# Altium schematic sheet Sheet_1_2023-06-10.schdoc
size 316 x 220 mm
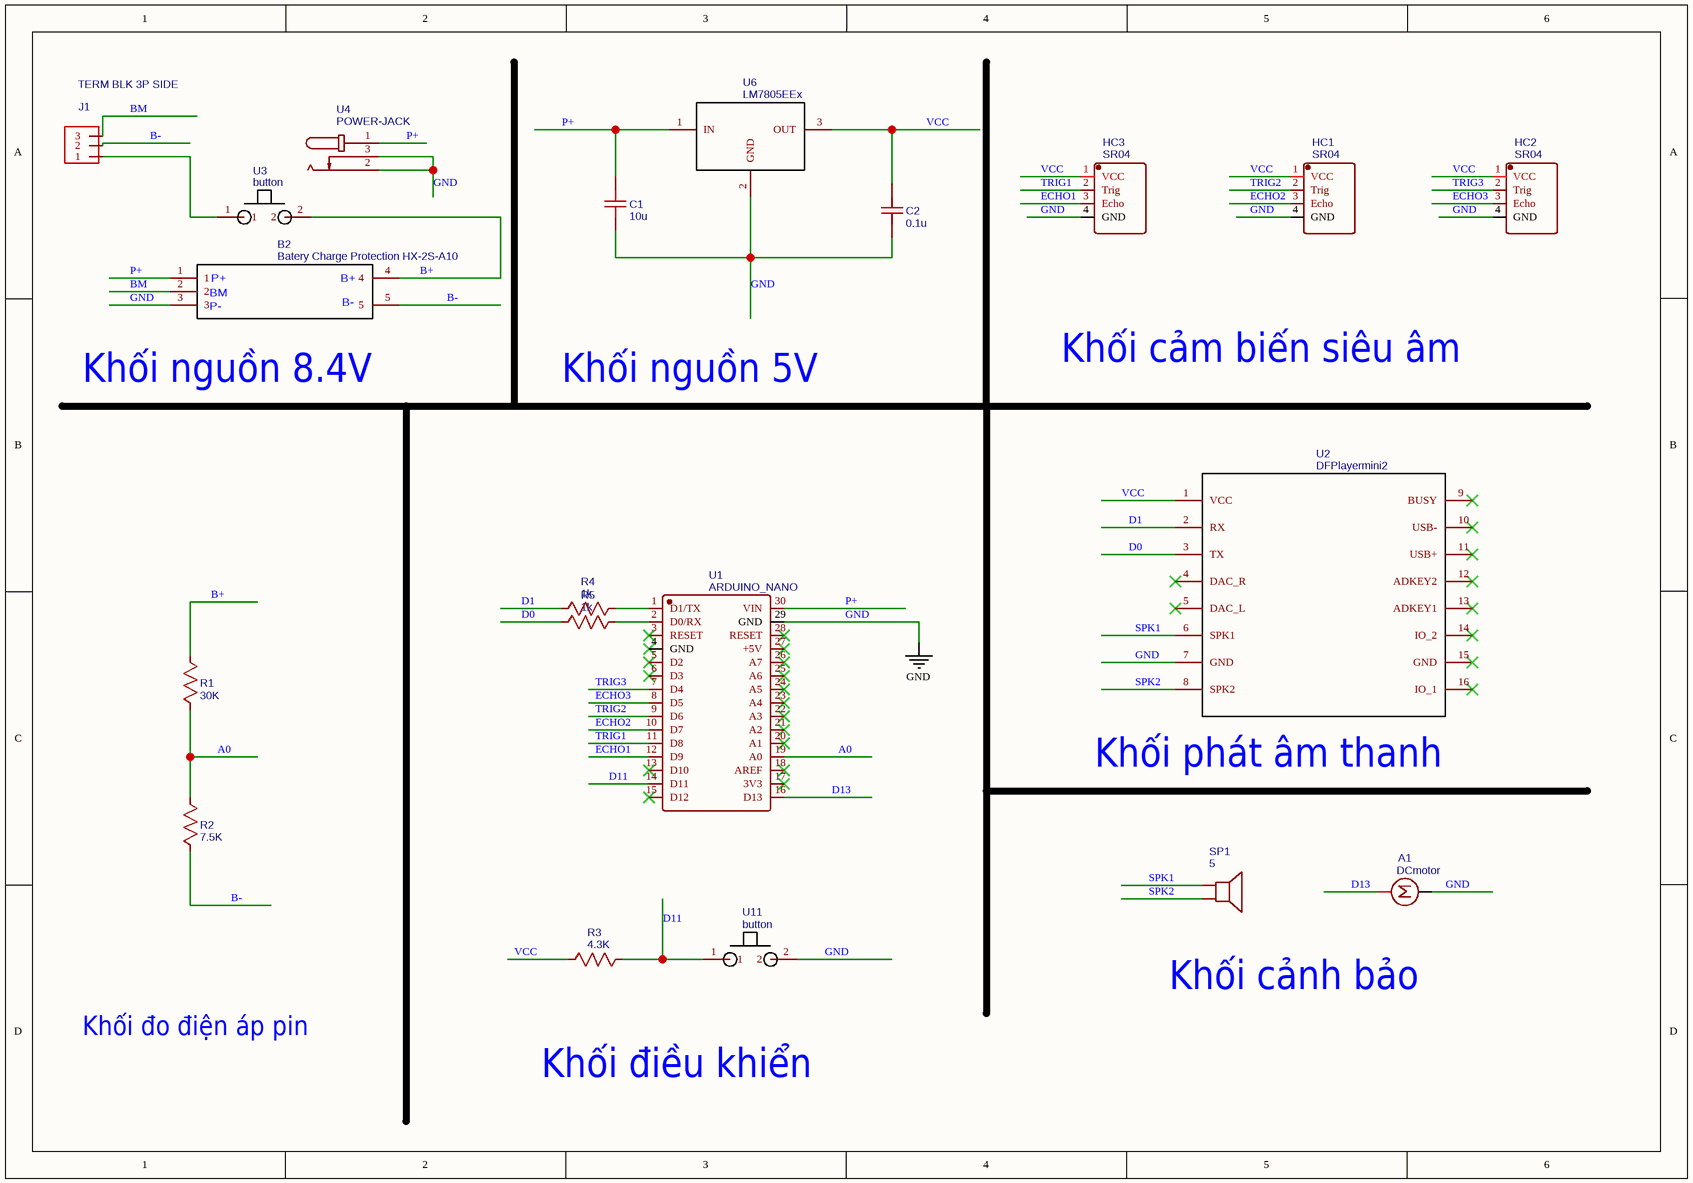
[diagram p0: Sheet_1_2023-06-10.schdoc]

## Parts
A1  DCmotor  [CONNECTOR_PINHEADER_2.54MM:PINHEADER_1X11_P_2.54MM]
B2  Batery Charge Protection HX-2S-A10  [HX-2S-A10]
C1  10u  [C0805]
C2  0.1u  [C0805]
HC1  SR04  [JSN-SR04T-3.0_1H]
HC2  SR04  [JSN-SR04T-3.0_1H]
HC3  SR04  [JSN-SR04T-3.0_1H]
J1  TERM BLK 3P SIDE  [PHOENIX TERM BLK 3P SIDE ENT 2.54MM PCB]
R1  30K  [R0805]
R2  7.5K  [R0805]
R3  4.3K  [R0805]
R4  1k  [R0805]
R5  1k  [R0805]
SP1  5  [HEADER]
U1  ARDUINO_NANO  [COMM-TH_ARDUINO_NANO]
U2  DFPlayermini2  [DFPLAYER]
U3  button  [HEADER]
U4  POWER-JACK  [DC-IN-TH_POWER-JACK]
U6  LM7805EEx  [LM7805]
U11  button  [HEADER]

## Nets
GND: A1.2 B2.3 C1.1 C2.1 HC1.4(GND) HC2.4(GND) HC3.4(GND) U1.29(GND) U2.7(GND) U4.2 U4.3 U6.2(GND) U11.2
A0: R1.1 R2.2 U1.19(A0)
B+: B2.4 R1.2 U3.2
B-: B2.5 J1.2 R2.1
BM: B2.2 J1.3
D0: R5.1 U2.3(TX)
D1: R4.1 U2.2(RX)
D11: R3.2 U1.14(D11) U11.1
D13: A1.1(+) U1.16(D13)
ECHO1: HC3.3(Echo) U1.12(D9)
ECHO2: HC1.3(Echo) U1.10(D7)
ECHO3: HC2.3(Echo) U1.8(D5)
P+: B2.1 C1.2 U1.30(VIN) U4.1 U6.1(IN)
SPK1: SP1.1(+) U2.6(SPK1)
SPK2: SP1.2(-) U2.8(SPK2)
TRIG1: HC3.2(Trig) U1.11(D8)
TRIG2: HC1.2(Trig) U1.9(D6)
TRIG3: HC2.2(Trig) U1.7(D4)
VCC: C2.2 HC1.1(VCC) HC2.1(VCC) HC3.1(VCC) R3.1 U2.1(VCC) U6.3(OUT)
NetJ1_1: J1.1 U3.1
NetR4_2: R4.2 U1.1(D1/TX)
NetR5_2: R5.2 U1.2(D0/RX)

Not connected (* = marked no-connect by the designer): U1 3(RESET)* 4(GND)* 5(D2)* 6(D3)* 13(D10)* 15(D12)* 17(3V3)* 18(AREF)* 20(A1)* 21(A2)* 22(A3)* 23(A4)* 24(A5)* 25(A6)* 26(A7)* 27(+5V)* 28(RESET)*; U2 4(DAC_R)* 5(DAC_L)* 9(BUSY)* 10(USB-)* 11(USB+)* 12(ADKEY2)* 13(ADKEY1)* 14(IO_2)* 15(GND)* 16(IO_1)*

## Notes on the sheet
- (near B2) Khối nguồn 8.4V
- Khối nguồn 5V
- Khối cảm biến siêu âm
- (near U2) Khối phát âm thanh
- Khối cảnh bảo
- Khối đo điện áp pin
- Khối điều khiển
- (in symbol Batery Charge Protection HX-2S-A10) P+; B+; BM; B-; P-

## Library data of the parts
A1 = DCmotor: Contributor: TONG JIAO; spicePre: X; spiceSymbolName: DCmotor
B2 = Batery Charge Protection HX-2S-A10: Contributor: VicenteOliverio; BOM_Manufacturer Part: HX-2S-A10; BOM_Supplier Part: HX-2S-A10; spicePre: B; spiceSymbolName: Batery Charge Protection HX-2S-A10
C1 = 10u: nameAlias: Value(F); Contributor: LCEDA_Lib; spicePre: C; spiceSymbolName: C_0603_US
C2 = 0.1u: nameAlias: Value(F); Contributor: LCEDA_Lib; spicePre: C; spiceSymbolName: C_0603_US
J1 = TERM BLK 3P SIDE: BOM_Manufacturer: Phoenix Contact; Contributor: grodda; BOM_Supplier Part: 1725669; spicePre: J; spiceSymbolName: TERM BLK 3P SIDE
R1 = 30K: nameAlias: Value(Ω); Contributor: LCEDA_Lib; spicePre: R; spiceSymbolName: R_0603_US
R2 = 7.5K: nameAlias: Value(Ω); Contributor: LCEDA_Lib; spicePre: R; spiceSymbolName: R_0603_US
R3 = 4.3K: nameAlias: Value(Ω); Contributor: LCEDA_Lib; spicePre: R; spiceSymbolName: R_0603_US
R4 R5 = 1k: nameAlias: Value(Ω); Contributor: LCEDA_Lib; spicePre: R; spiceSymbolName: R_0603_US
SP1 = 5: nameAlias: Value(Ω); sim: true; Contributor: maximus250372; BOM_Supplier: LCSC; spicePre: S; spiceSymbolName: SPEAKER
U1 = ARDUINO_NANO: BOM_Manufacturer: null; Contributor: lcsc; BOM_Supplier: LCSC; BOM_Supplier Part: C9900017879; BOM_Manufacturer Part: ARDUINO_NANO; BOM_JLCPCB Part Class: Extended Part; spicePre: U; spiceSymbolName: ARDUINO_NANO
U2 = DFPlayermini2: nameAlias: Model; catid: 20; Contributor: jonithan; spicePre: X; BOM_Manufacturer Part: DFPlayer mini; spiceSymbolName: DFPlayermini2
U3 U11 = button: nameAlias: Model; catid: 20; Contributor: visal; sim: true; spicePre: X; spiceSymbolName: button
U4 = POWER-JACK: BOM_Manufacturer: null; Contributor: LCSC; BOM_Supplier: LCSC; BOM_Supplier Part: C9900001795; BOM_Manufacturer Part: POWER-JACK; BOM_JLCPCB Part Class: Extended Part; spicePre: U; spiceSymbolName: POWER-JACK
U6 = LM7805EEx: nameAlias: Model; Contributor: artur2000; Package Display: No; spicePre: X; spiceSymbolName: LM7805EEx
HC1-HC3 = SR04: spicePre: X; spiceSymbolName: SR04